# Altium schematic sheet AT24C.SchDoc
size A4
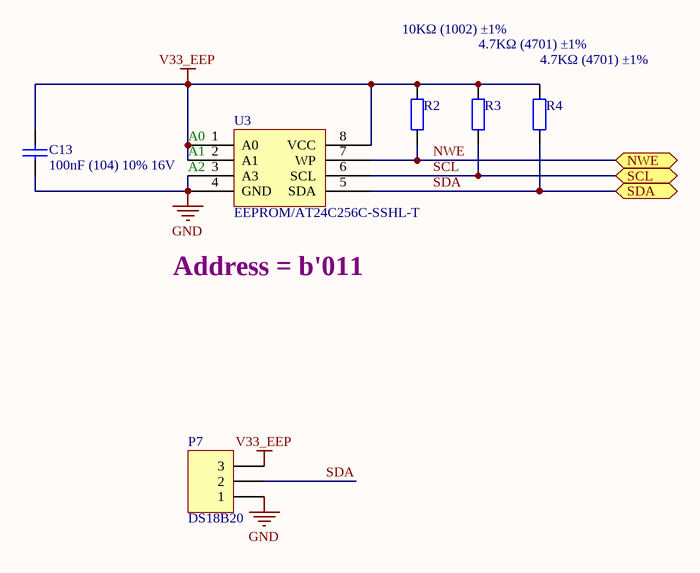
[diagram p0: AT24C.SchDoc]

## Parts
C13  100nF (104) 10% 16V  [0402_C]
P7  DS18B20  [TO-92A]
R2  10KΩ (1002) ±1%  [0402_R]
R3  4.7KΩ (4701) ±1%  [0402_R]
R4  4.7KΩ (4701) ±1%  [0402_R]
U3  EEPROM/AT24C256C-SSHL-T  [SOIC-8_150mil]

## Ports
NWE, SCL, SDA

## Nets
GND: C13.1 P7.1 U3.3(A3) U3.4(GND)
V33_EEP: C13.2 P7.3 R2.2 R3.2 R4.2 U3.1(A0) U3.2(A1) U3.8(VCC)
NWE: R2.1 U3.7(WP) ; port NWE
SCL: R3.1 U3.6(SCL) ; port SCL
SDA: P7.2 R4.1 U3.5(SDA) ; port SDA

## Notes on the sheet
- (near U3) A2
- (near U3) A0
- (near U3) A1
- Address = b'011

## Library data of the parts
C13 = 0402 100nF (104) 10% 16V: 贴片电容; ComponentLink1Description: 供应商链接; ComponentLink1URL: http://www.szlcsc.com/product/details_1877.html; Package: 0402; Supplier: LC; SuppliersPartNumber: C1525
P7 = Header 3: Header, 3-Pin; LatestRevisionDate: 17-Jul-2002; LatestRevisionNote: Re-released for DXP Platform.; Publisher: Altium Limited
R2 = 0402 10KΩ (1002) 1%: 贴片电阻; ComponentLink1Description: 供应商链接; ComponentLink1URL: http://www.szlcsc.com/product/details_26487.html; Package: 0402; Supplier: LC; SuppliersPartNumber: C25744
R3 R4 = 0402 4.7KΩ (4701) 1%: 贴片电阻; ComponentLink1Description: 供应商链接; ComponentLink1URL: http://www.szlcsc.com/product/details_26643.html; Package: 0402; Supplier: LC; SuppliersPartNumber: C25900
U3 = EEPROM/AT24C256C-SSHL-T_[C6482]: EEPROM; ComponentLink1Description: 供应商链接; ComponentLink1URL: http://www.szlcsc.com/product/details_6947.html; Package: SOIC-8_150mil; Supplier: LC; SuppliersPartNumber: C6482